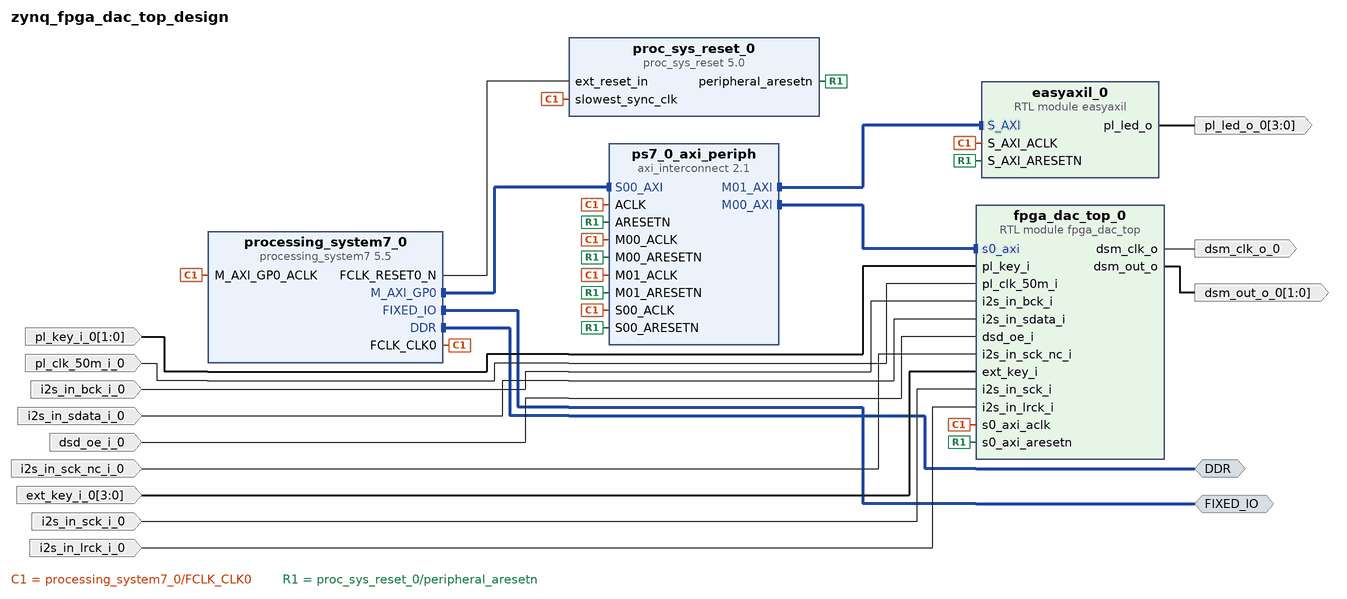
[diagram p0: block diagram of the top level]
# Vivado block design zynq_fpga_dac_top_design, xc7z010clg400-1, Vivado 2019.1
create_bd_design zynq_fpga_dac_top_design

create_bd_intf_port -mode Master -vlnv xilinx.com:interface:ddrx_rtl:1.0 DDR
create_bd_intf_port -mode Master -vlnv xilinx.com:display_processing_system7:fixedio_rtl:1.0 FIXED_IO
create_bd_port -dir I -from 1 -to 0 pl_key_i_0
create_bd_port -dir O -from 3 -to 0 pl_led_o_0
create_bd_port -dir I pl_clk_50m_i_0
create_bd_port -dir I i2s_in_bck_i_0
create_bd_port -dir O -from 1 -to 0 dsm_out_o_0
create_bd_port -dir I i2s_in_sdata_i_0
create_bd_port -dir I dsd_oe_i_0
create_bd_port -dir I i2s_in_sck_nc_i_0
create_bd_port -dir I -from 3 -to 0 ext_key_i_0
create_bd_port -dir I i2s_in_sck_i_0
create_bd_port -dir I i2s_in_lrck_i_0
create_bd_port -dir O dsm_clk_o_0

create_bd_cell -type ip -vlnv xilinx.com:ip:processing_system7:5.5 processing_system7_0
set_property -dict [list \
  CONFIG.PCW_PRESET_BANK1_VOLTAGE {LVCMOS 1.8V} \
  CONFIG.PCW_UIPARAM_DDR_BUS_WIDTH {16 Bit} \
  CONFIG.PCW_UIPARAM_DDR_PARTNO {MT41J256M16 RE-125} \
  CONFIG.PCW_USB0_PERIPHERAL_ENABLE 0 \
] [get_bd_cells processing_system7_0]
# 8 more settings of processing_system7_0 are not shown: defaults, MIO pin electricals, DDR timing, and values the tool derives
create_bd_cell -type ip -vlnv xilinx.com:ip:proc_sys_reset:5.0 proc_sys_reset_0
create_bd_cell -type ip -vlnv xilinx.com:ip:axi_interconnect:2.1 ps7_0_axi_periph
set_property -dict {CONFIG.NUM_MI 2} [get_bd_cells ps7_0_axi_periph]
create_bd_cell -type module -reference fpga_dac_top fpga_dac_top_0
create_bd_cell -type module -reference easyaxil easyaxil_0

# ---- connections ----

connect_bd_intf_net [get_bd_intf_pins ps7_0_axi_periph/M00_AXI] [get_bd_intf_pins fpga_dac_top_0/s0_axi]
connect_bd_intf_net [get_bd_intf_ports FIXED_IO] [get_bd_intf_pins processing_system7_0/FIXED_IO]
connect_bd_intf_net [get_bd_intf_pins ps7_0_axi_periph/M01_AXI] [get_bd_intf_pins easyaxil_0/S_AXI]
connect_bd_intf_net [get_bd_intf_pins processing_system7_0/M_AXI_GP0] [get_bd_intf_pins ps7_0_axi_periph/S00_AXI]
connect_bd_intf_net [get_bd_intf_ports DDR] [get_bd_intf_pins processing_system7_0/DDR]
connect_bd_net [get_bd_pins processing_system7_0/FCLK_CLK0] \
  [get_bd_pins processing_system7_0/M_AXI_GP0_ACLK] [get_bd_pins proc_sys_reset_0/slowest_sync_clk] \
  [get_bd_pins ps7_0_axi_periph/S00_ACLK] [get_bd_pins ps7_0_axi_periph/M00_ACLK] [get_bd_pins ps7_0_axi_periph/ACLK] \
  [get_bd_pins fpga_dac_top_0/s0_axi_aclk] [get_bd_pins easyaxil_0/S_AXI_ACLK] [get_bd_pins ps7_0_axi_periph/M01_ACLK]
connect_bd_net [get_bd_pins processing_system7_0/FCLK_RESET0_N] [get_bd_pins proc_sys_reset_0/ext_reset_in]
connect_bd_net -net pl_key_i_0_1 [get_bd_ports pl_key_i_0] [get_bd_pins fpga_dac_top_0/pl_key_i]
connect_bd_net -net pl_clk_50m_i_0_1 [get_bd_ports pl_clk_50m_i_0] [get_bd_pins fpga_dac_top_0/pl_clk_50m_i]
connect_bd_net -net i2s_in_bck_i_0_1 [get_bd_ports i2s_in_bck_i_0] [get_bd_pins fpga_dac_top_0/i2s_in_bck_i]
connect_bd_net [get_bd_pins fpga_dac_top_0/dsm_out_o] [get_bd_ports dsm_out_o_0]
connect_bd_net -net i2s_in_sdata_i_0_1 [get_bd_ports i2s_in_sdata_i_0] [get_bd_pins fpga_dac_top_0/i2s_in_sdata_i]
connect_bd_net -net dsd_oe_i_0_1 [get_bd_ports dsd_oe_i_0] [get_bd_pins fpga_dac_top_0/dsd_oe_i]
connect_bd_net -net i2s_in_sck_nc_i_0_1 [get_bd_ports i2s_in_sck_nc_i_0] [get_bd_pins fpga_dac_top_0/i2s_in_sck_nc_i]
connect_bd_net -net ext_key_i_0_1 [get_bd_ports ext_key_i_0] [get_bd_pins fpga_dac_top_0/ext_key_i]
connect_bd_net -net i2s_in_sck_i_0_1 [get_bd_ports i2s_in_sck_i_0] [get_bd_pins fpga_dac_top_0/i2s_in_sck_i]
connect_bd_net -net i2s_in_lrck_i_0_1 [get_bd_ports i2s_in_lrck_i_0] [get_bd_pins fpga_dac_top_0/i2s_in_lrck_i]
connect_bd_net [get_bd_pins fpga_dac_top_0/dsm_clk_o] [get_bd_ports dsm_clk_o_0]
connect_bd_net [get_bd_pins proc_sys_reset_0/peripheral_aresetn] \
  [get_bd_pins ps7_0_axi_periph/S00_ARESETN] [get_bd_pins ps7_0_axi_periph/M00_ARESETN] \
  [get_bd_pins ps7_0_axi_periph/ARESETN] [get_bd_pins fpga_dac_top_0/s0_axi_aresetn] [get_bd_pins easyaxil_0/S_AXI_ARESETN] \
  [get_bd_pins ps7_0_axi_periph/M01_ARESETN]
connect_bd_net [get_bd_pins easyaxil_0/pl_led_o] [get_bd_ports pl_led_o_0]

# ---- address map ----
assign_bd_address -offset 0x40000000 -range 4K -target_address_space [get_bd_addr_spaces processing_system7_0/Data] [get_bd_addr_segs fpga_dac_top_0/s0_axi/reg0]
assign_bd_address -offset 0x40001000 -range 4K -target_address_space [get_bd_addr_spaces processing_system7_0/Data] [get_bd_addr_segs easyaxil_0/S_AXI/reg0]

validate_bd_design
save_bd_design
